# EasyEDA Pro project ProPrj_3x3motorFPGA_2025-06-10.epro, schematic gyro_sens
Create Date: 2025-06-04; Page Name: P1; Project Name: 3x3motorFPGA; Schematic Name: gyro_sens; Update Date: 2025-06-04; Company: EasyEDA.com; Page Size: A4; Version: V1.0
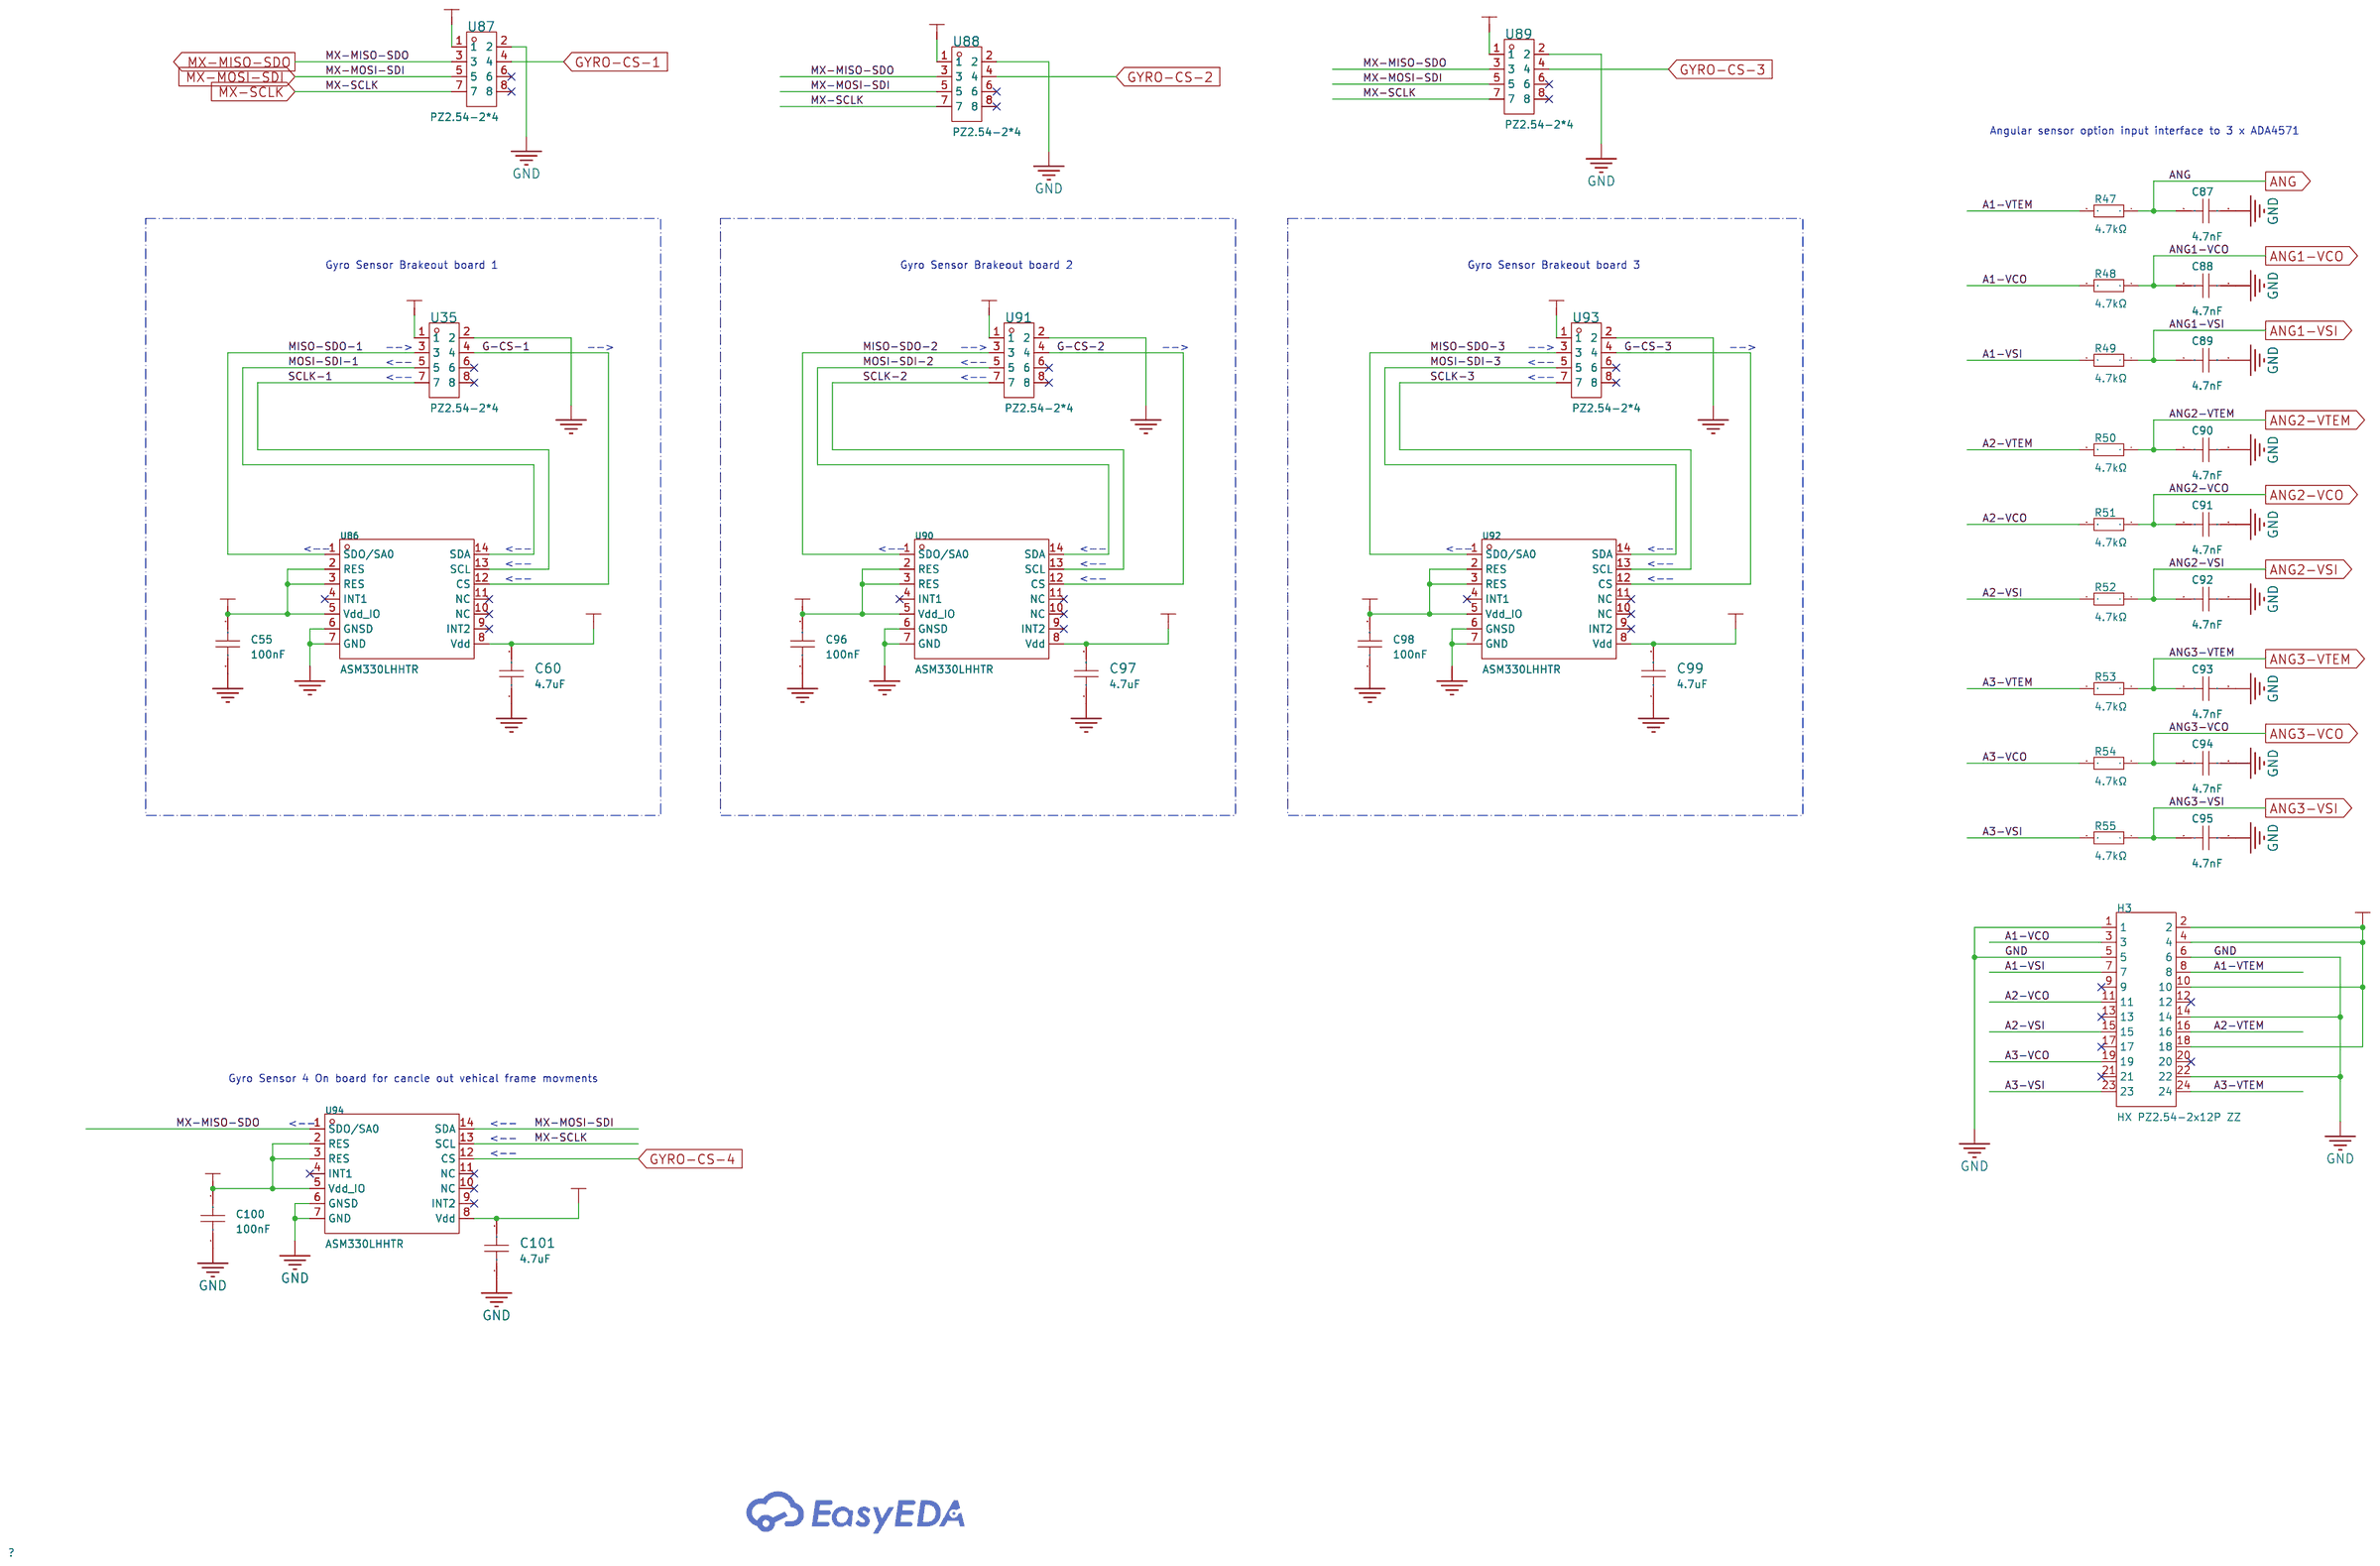
[diagram p5: schematic sheet]

## Parts
C55  100nF  [C0402]
C60  4.7uF  [C0402]
C87  4.7nF  [C0402]
C88  4.7nF  [C0402]
C89  4.7nF  [C0402]
C90  4.7nF  [C0402]
C91  4.7nF  [C0402]
C92  4.7nF  [C0402]
C93  4.7nF  [C0402]
C94  4.7nF  [C0402]
C95  4.7nF  [C0402]
C96  100nF  [C0402]
C97  4.7uF  [C0402]
C98  100nF  [C0402]
C99  4.7uF  [C0402]
C100  100nF  [C0402]  (no BOM)
C101  4.7uF  [C0402]  (no BOM)
H3  HX PZ2.54-2x12P ZZ  [HDR-TH_24P-P2.54-V-M-R2-C12-S2.54]  (no BOM)
R47  4.7kΩ  [R0402]
R48  4.7kΩ  [R0402]
R49  4.7kΩ  [R0402]
R50  4.7kΩ  [R0402]
R51  4.7kΩ  [R0402]
R52  4.7kΩ  [R0402]
R53  4.7kΩ  [R0402]
R54  4.7kΩ  [R0402]
R55  4.7kΩ  [R0402]
U35  PZ2.54-2*4  [HDR-TH_8P-P2.54-V-M-R2-C4-S2.54]
U86  ASM330LHHTR  [LGA-14L_L3.0-W2.5-P0.50-TL]
U87  PZ2.54-2*4  [HDR-TH_8P-P2.54-V-M-R2-C4-S2.54]
U88  PZ2.54-2*4  [HDR-TH_8P-P2.54-V-M-R2-C4-S2.54]
U89  PZ2.54-2*4  [HDR-TH_8P-P2.54-V-M-R2-C4-S2.54]
U90  ASM330LHHTR  [LGA-14L_L3.0-W2.5-P0.50-TL]
U91  PZ2.54-2*4  [HDR-TH_8P-P2.54-V-M-R2-C4-S2.54]
U92  ASM330LHHTR  [LGA-14L_L3.0-W2.5-P0.50-TL]
U93  PZ2.54-2*4  [HDR-TH_8P-P2.54-V-M-R2-C4-S2.54]
U94  ASM330LHHTR  [LGA-14L_L3.0-W2.5-P0.50-TL]  (no BOM)

## Library data of the parts
C55 C96 C98 C100 = CL05B104KB54PNC: Capacitance: Tolerance:±10% Tolerance:±10% Voltage Rated: Temperature Coefficient:; LCSC Part Name: 100nF ±10% 50V; Supplier Part: C307331; Manufacturer: SAMSUNG(三星); Supplier Footprint: 0402; JLCPCB Part Class: Basic Part; Datasheet: https://atta.szlcsc.com/upload/public/pdf/source/20160218/1457707763339.pdf; Supplier: LCSC; Tolerance: ±10%; Check: true
C60 C97 C99 C101 = LMK105BBJ475MVLF: Capacitance: Tolerance:±20% Tolerance:±20% Voltage Rated: Temperature Coefficient:; LCSC Part Name: 4.7uF ±20% 10V; Supplier Part: C386043; Manufacturer: TAIYO YUDEN(太诱); Supplier Footprint: 0402; JLCPCB Part Class: Extended Part; Datasheet: https://atta.szlcsc.com/upload/public/pdf/source/20210525/C2802164_C0429B055888A674C3F00BA74B841C5B.pdf; Supplier: LCSC; Tolerance: ±20%; Check: true
C87-C95 = 0402B472K500NT: Capacitance:4.7nF Tolerance:±10% Tolerance:±10% Voltage Rating:50V Temperature Coefficient:X7R; LCSC Part Name: 4.7nF ±10% 50V; Supplier Part: C1538; Manufacturer: FH(风华); Supplier Footprint: 0402; JLCPCB Part Class: Basic Part; Datasheet: https://atta.szlcsc.com/upload/public/pdf/source/20200305/C486355_26A10D38EF8C2A5C37091D0039909270.pdf; Supplier: LCSC; Tolerance: ±10%; Voltage Rating: 50V; Temperature Coefficient: X7R
H3 = HX PZ2.54-2x12P ZZ: Pin Structure:2x12P Pitch:2.54mm Row Spacing:2.54mm Circluar Pins/Square Pins:Policy Number of Rows:Double Row Number of Pins:24P Current Rating:3A Length of Mating Pin:6mm Insulation Height:2.5mm Length of End Connection Pin:3mm Contact Plating:Gold Oper; LCSC Part Name: 间距:2.54mm 2x12P 直针; Supplier Part: C42372520; Manufacturer: hanxia(韩下); Supplier Footprint: 插件,P=2.54mm; Datasheet: https://atta.szlcsc.com/upload/public/pdf/source/20241030/FABA9924355EF3ED6720AD656562B1EA.pdf; Supplier: LCSC; Pin Structure: 2x12P; Pitch: 2.54mm; Row Spacing: 2.54mm; Circluar Pins/Square Pins: Policy; Number of Rows: Double Row; Number of Pins: 24P; Current Rating: 3A; Length of Mating Pin: 6mm; Insulation Height: 2.5mm; Length of End Connection Pin: 3mm; Contact Plating: Gold; Operating Temperature: -40℃~+105℃; Color: Black; Check: true
R47-R55 = 0402WGF4701TCE: Type:Thick Film Resistors Resistance:4.7kΩ Tolerance:±1% Tolerance:±1% Power(Watts): Overload Voltage (Max): Temperature Coefficient:±100ppm/℃ Temperature Coefficient:±100ppm/℃ Operating Temperature Range:-55℃~+155℃ Operating Temperature Range:-55℃~+155℃; LCSC Part Name: 4.7kΩ ±1% 62.5mW 厚膜电阻; Supplier Part: C25900; Manufacturer: UNI-ROYAL(厚声); Supplier Footprint: 0402; JLCPCB Part Class: Basic Part; Datasheet: https://atta.szlcsc.com/upload/public/pdf/source/20200306/C422600_1E6D84923E4A46A82E41ADD87F860B5C.pdf; Supplier: LCSC; Type: Thick Film Resistors; Tolerance: ±1%; Temperature Coefficient: ±100ppm/℃; Operating Temperature Range: -55℃~+155℃
U35 U87-U89 U91 U93 = PZ2.54-2*4: Pin Structure:2x4P Pitch:2.54mm Number of Rows:双排 Number of Pins:8P; Supplier Part: C5156676; Manufacturer: ZHOURI(洲日); Supplier Footprint: 插件,P=2.54mm; JLCPCB Part Class: Extended Part; Datasheet: https://atta.szlcsc.com/upload/public/pdf/source/20220923/0E7A4A94740FFD503E2D73F36F92C1EA.pdf; Supplier: LCSC; Pin Structure: 2x4P; Pitch: 2.54mm; Number of Rows: 双排; Number of Pins: 8P; Check: true
U86 U90 U92 U94 = ASM330LHHTR: Sensor Type:加速度计陀螺仪 Operating Temperature:-40℃~+105℃ Operating Temperature:-40℃~+105℃; Supplier Part: C459826; Manufacturer: ST(意法半导体); Supplier Footprint: LGA-14(2.5x3); JLCPCB Part Class: Extended Part; Datasheet: https://atta.szlcsc.com/upload/public/pdf/source/20191121/C459826_D2BF649B6E4256E506E5100F24CF670E.pdf; Supplier: LCSC; Sensor Type: 加速度计陀螺仪; Operating Temperature: -40℃~+105℃

## Nets
3.3V: C100.2 C101.2 H3.2 H3.4 H3.10 H3.18 U87.1 U88.1 U89.1 U94.2(RES) U94.3(RES) U94.5(Vdd_IO) U94.8(Vdd)
3.3V-1: C55.2 C60.2 U35.1 U86.2(RES) U86.3(RES) U86.5(Vdd_IO) U86.8(Vdd)
3.3V-2: C96.2 C97.2 U90.2(RES) U90.3(RES) U90.5(Vdd_IO) U90.8(Vdd) U91.1
3.3V-3: C98.2 C99.2 U92.2(RES) U92.3(RES) U92.5(Vdd_IO) U92.8(Vdd) U93.1
GND: C87.2 C88.2 C89.2 C90.2 C91.2 C92.2 C93.2 C94.2 C95.2 C100.1 C101.1 H3.1 H3.5 H3.6 H3.14 H3.22 U87.2 U88.2 U89.2 U94.6(GNSD) U94.7(GND)
GND-1: C55.1 C60.1 U35.2 U86.6(GNSD) U86.7(GND)
GND-2: C96.1 C97.1 U90.6(GNSD) U90.7(GND) U91.2
GND-3: C98.1 C99.1 U92.6(GNSD) U92.7(GND) U93.2
A1-VCO: H3.3 R48.2
A1-VSI: H3.7 R49.2
A1-VTEM: H3.8 R47.2
A2-VCO: H3.11 R51.2
A2-VSI: H3.15 R52.2
A2-VTEM: H3.16 R50.2
A3-VCO: H3.19 R54.2
A3-VSI: H3.23 R55.2
A3-VTEM: H3.24 R53.2
ANG: C87.1 R47.1
ANG1-VCO: C88.1 R48.1
ANG1-VSI: C89.1 R49.1
ANG2-VCO: C91.1 R51.1
ANG2-VSI: C92.1 R52.1
ANG2-VTEM: C90.1 R50.1
ANG3-VCO: C94.1 R54.1
ANG3-VSI: C95.1 R55.1
ANG3-VTEM: C93.1 R53.1
G-CS-1: U35.4 U86.12(CS)
G-CS-2: U90.12(CS) U91.4
G-CS-3: U92.12(CS) U93.4
GYRO-CS-1: U87.4
GYRO-CS-2: U88.4
GYRO-CS-3: U89.4
GYRO-CS-4: U94.12(CS)
MISO-SDO-1: U35.3 U86.1(SDO/SA0)
MISO-SDO-2: U90.1(SDO/SA0) U91.3
MISO-SDO-3: U92.1(SDO/SA0) U93.3
MOSI-SDI-1: U35.5 U86.14(SDA)
MOSI-SDI-2: U90.14(SDA) U91.5
MOSI-SDI-3: U92.14(SDA) U93.5
MX-MISO-SDO: U87.3 U88.3 U89.3 U94.1(SDO/SA0)
MX-MOSI-SDI: U87.5 U88.5 U89.5 U94.14(SDA)
MX-SCLK: U87.7 U88.7 U89.7 U94.13(SCL)
SCLK-1: U35.7 U86.13(SCL)
SCLK-2: U90.13(SCL) U91.7
SCLK-3: U92.13(SCL) U93.7

Not connected (* = marked no-connect by the designer): H3 9* 12* 13* 17* 20* 21*; U35 6* 8*; U86 4(INT1)* 9(INT2)* 10(NC)* 11(NC)*; U87 6* 8*; U88 6* 8*; U89 6* 8*; U90 4(INT1)* 9(INT2)* 10(NC)* 11(NC)*; U91 6* 8*; U92 4(INT1)* 9(INT2)* 10(NC)* 11(NC)*; U93 6* 8*; U94 4(INT1)* 9(INT2)* 10(NC)* 11(NC)*

## Notes on the sheet
- Angular sensor option input interface to 3 x ADA4571
- Gyro Sensor Brakeout board 1
- Gyro Sensor Brakeout board 2
- Gyro Sensor Brakeout board 3
- -->
- -->
- -->
- -->
- -->
- -->
- <--
- <--
- <--
- <--
- <--
- <--
- <--
- <--
- <--
- <--
- <--
- <--
- <--
- <--
- <--
- <--
- <--
- <--
- Gyro Sensor 4 On board for cancle out vehical frame movments
- <--
- <--
- <--
- <--
